# EAGLE design mitutoyo-spc-data-logger (EAGLE 5.11)
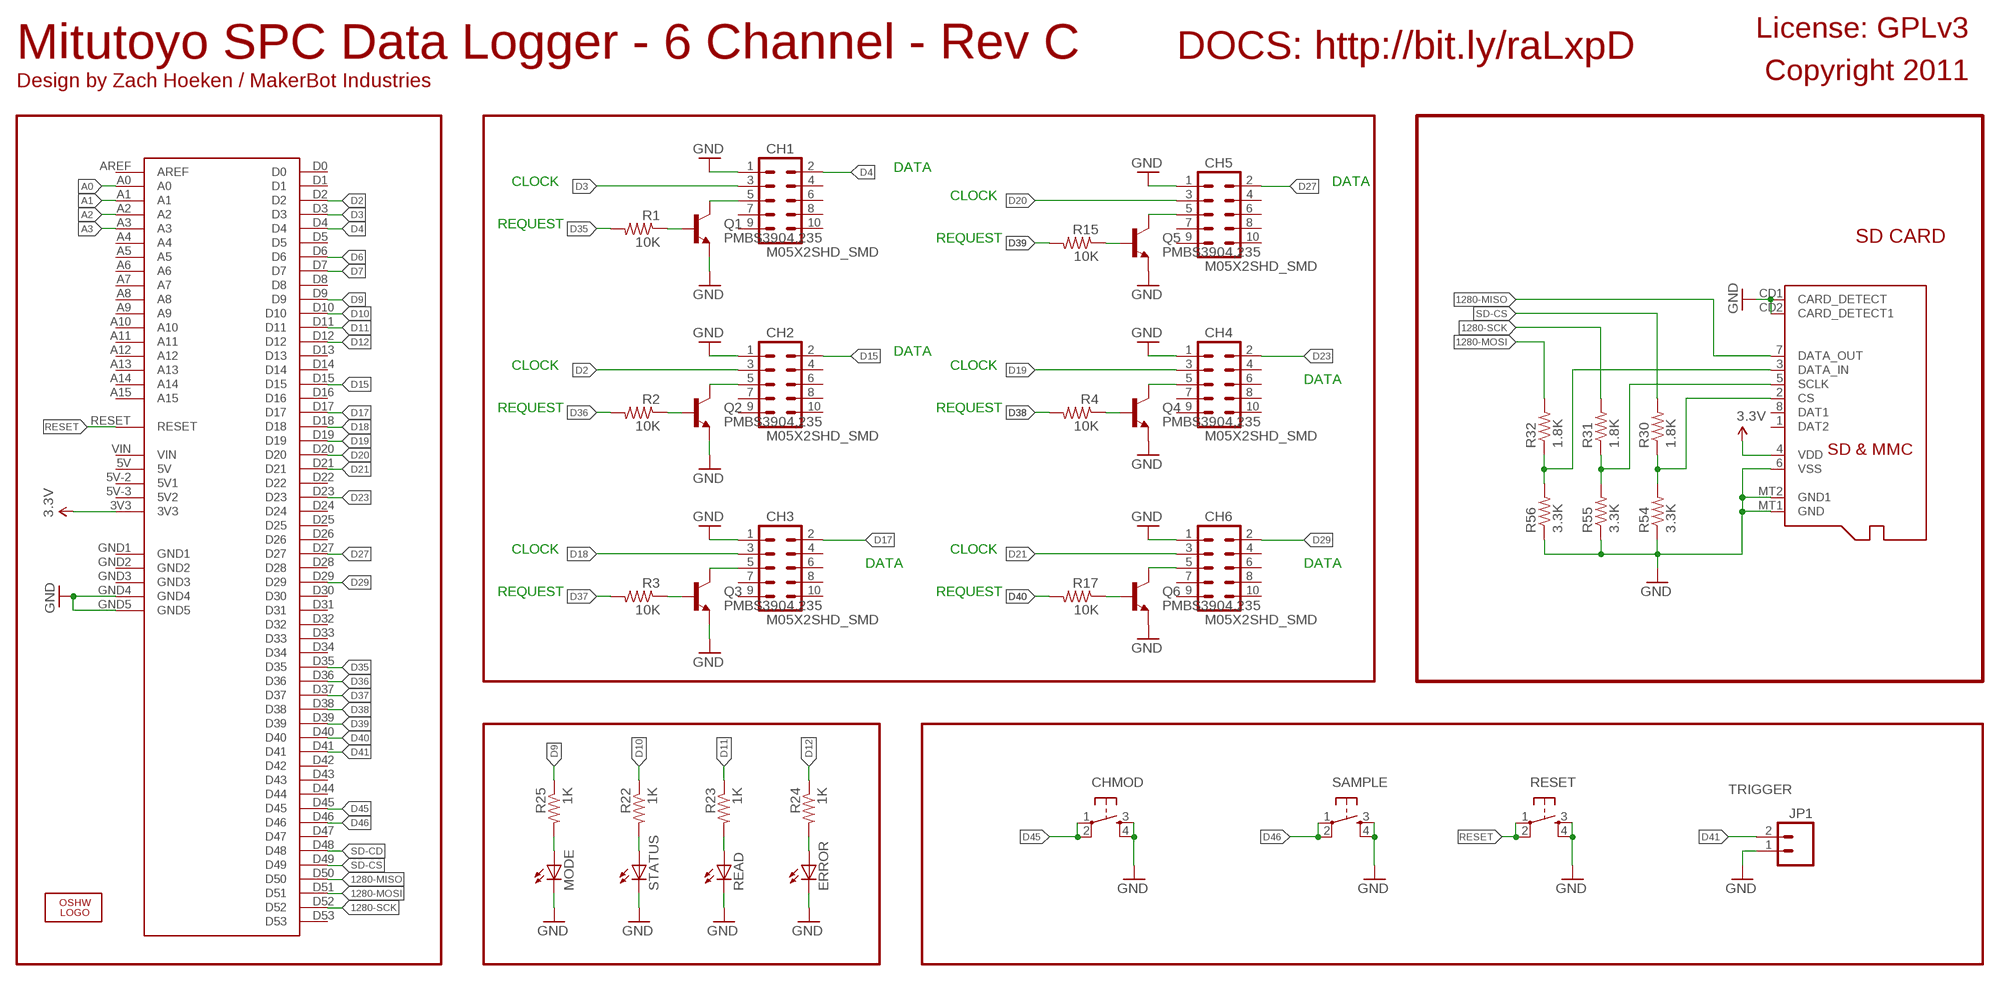
[diagram p0: schematic, sheet 1]

## Parts
CH1  M05X2SHD_SMD  [2X5-SHROUDED_SMD]
CH2  M05X2SHD_SMD  [2X5-SHROUDED_SMD]
CH3  M05X2SHD_SMD  [2X5-SHROUDED_SMD]
CH4  M05X2SHD_SMD  [2X5-SHROUDED_SMD]
CH5  M05X2SHD_SMD  [2X5-SHROUDED_SMD]
CH6  M05X2SHD_SMD  [2X5-SHROUDED_SMD]
CHMOD  TAC_SWITCHSMD  [TACTILE_SWITCH_SMD]
ERROR  LED1206  [LED-1206]
JP1  M02-JST-2MM-SMT  [S2B-PH]
LOGO2  OSHW_LOGO_10MILX0200-NT  [OSHW_10X200_NOTEXT]
MODE  LED1206  [LED-1206]
MP1  DNP  MICROSD  [MICROSD]
Q1  PMBS3904,235  TRANSISTOR_NPNSOT23  [SOT23]
Q2  PMBS3904,235  TRANSISTOR_NPNSOT23  [SOT23]
Q3  PMBS3904,235  TRANSISTOR_NPNSOT23  [SOT23]
Q4  PMBS3904,235  TRANSISTOR_NPNSOT23  [SOT23]
Q5  PMBS3904,235  TRANSISTOR_NPNSOT23  [SOT23]
Q6  PMBS3904,235  TRANSISTOR_NPNSOT23  [SOT23]
R1  10K  RESISTOR  [0805]
R2  10K  RESISTOR  [0805]
R3  10K  RESISTOR  [0805]
R4  10K  RESISTOR  [0805]
R15  10K  RESISTOR  [0805]
R17  10K  RESISTOR  [0805]
R22  1K  RESISTOR  [0805]
R23  1K  RESISTOR  [0805]
R24  1K  RESISTOR  [0805]
R25  1K  RESISTOR  [0805]
R30  1.8K  RESISTOR  [0805]
R31  1.8K  RESISTOR  [0805]
R32  1.8K  RESISTOR  [0805]
R54  3.3K  RESISTOR  [0805]
R55  3.3K  RESISTOR  [0805]
R56  3.3K  RESISTOR  [0805]
READ  LED1206  [LED-1206]
RESET  TAC_SWITCHSMD  [TACTILE_SWITCH_SMD]
SAMPLE  TAC_SWITCHSMD  [TACTILE_SWITCH_SMD]
STATUS  LED1206  [LED-1206]
U$1  ARDUINO-MEGA  [ARDUINO-MEGA]

## Nets
3.3V [3.3V]: MP1.4(VDD) U$1.3V3
1280-MISO: MP1.7(DATA_OUT) U$1.D50
1280-MOSI: R32.2 U$1.D51
1280-SCK: R31.2 U$1.D52
A0: U$1.A0
A1: U$1.A1
A2: U$1.A2
A3: U$1.A3
D2: CH2.3 U$1.D2
D3: CH1.3 U$1.D3
D4: CH1.2 U$1.D4
D6: U$1.D6
D7: U$1.D7
D9: R25.1 U$1.D9
D10: R22.1 U$1.D10
D11: R23.1 U$1.D11
D12: R24.1 U$1.D12
D15: CH2.2 U$1.D15
D17: CH3.2 U$1.D17
D18: CH3.3 U$1.D18
D19: CH4.3 U$1.D19
D20: CH5.3 U$1.D20
D21: CH6.3 U$1.D21
D23: CH4.2 U$1.D23
D27: CH5.2 U$1.D27
D29: CH6.2 U$1.D29
D35: R1.2 U$1.D35
D36: R2.2 U$1.D36
D37: R3.2 U$1.D37
D38: R4.2 U$1.D38
D39: R15.2 U$1.D39
D40: R17.2 U$1.D40
D41: JP1.2 U$1.D41
D45: CHMOD.1 CHMOD.2 U$1.D45
D46: SAMPLE.1 SAMPLE.2 U$1.D46
GND [gnd]: CH1.1 CH2.1 CH3.1 CH4.1 CH5.1 CH6.1 CHMOD.3 CHMOD.4 ERROR.C JP1.1 MODE.C MP1.6(VSS) MP1.CD1(CARD_DETECT) MP1.CD2(CARD_DETECT1) MP1.MT1(GND) MP1.MT2(GND1) Q1.2(E) Q2.2(E) Q3.2(E) Q4.2(E) Q5.2(E) Q6.2(E) R54.1 R55.1 R56.1 READ.C RESET.3 RESET.4 SAMPLE.3 SAMPLE.4 STATUS.C U$1.GND4 U$1.GND5
N$1: Q5.1(B) R15.1
N$2: CH1.5 Q1.3(C)
N$3: CH3.5 Q3.3(C)
N$4: CH4.5 Q4.3(C)
N$5: CH2.5 Q2.3(C)
N$6: Q6.1(B) R17.1
N$7: CH6.5 Q6.3(C)
N$8: CH5.5 Q5.3(C)
N$9: Q1.1(B) R1.1
N$10: R22.2 STATUS.A
N$11: Q2.1(B) R2.1
N$12: R23.2 READ.A
N$13: ERROR.A R24.2
N$14: Q3.1(B) R3.1
N$15: MODE.A R25.2
N$17: Q4.1(B) R4.1
N$219: MP1.2(CS) R30.1 R54.2
N$223: MP1.3(DATA_IN) R32.1 R56.2
N$224: MP1.5(SCLK) R31.1 R55.2
RESET: RESET.1 RESET.2 U$1.RESET
SD-CD: U$1.D48
SD-CS: R30.2 U$1.D49
Unconnected: CH1.4 CH1.6 CH1.7 CH1.8 CH1.9 CH1.10 CH2.4 CH2.6 CH2.7 CH2.8 CH2.9 CH2.10 CH3.4 CH3.6 CH3.7 CH3.8 CH3.9 CH3.10 CH4.4 CH4.6 CH4.7 CH4.8 CH4.9 CH4.10 CH5.4 CH5.6 CH5.7 CH5.8 CH5.9 CH5.10 CH6.4 CH6.6 CH6.7 CH6.8 CH6.9 CH6.10 MP1.1(DAT2) MP1.8(DAT1) U$1.5V U$1.5V-2(5V1) U$1.5V-3(5V2) U$1.A4 U$1.A5 U$1.A6 U$1.A7 U$1.A8 U$1.A9 U$1.A10 U$1.A11 U$1.A12 U$1.A13 U$1.A14 U$1.A15 U$1.AREF U$1.D0 U$1.D1 U$1.D5 U$1.D8 U$1.D13 U$1.D14 U$1.D16 U$1.D22 U$1.D24 U$1.D25 U$1.D26 U$1.D28 U$1.D30 U$1.D31 U$1.D32 U$1.D33 U$1.D34 U$1.D42 U$1.D43 U$1.D44 U$1.D47 U$1.D53 U$1.GND1 U$1.GND2 U$1.GND3 U$1.VIN

## Notes on the sheet
- License: GPLv3
- Mitutoyo SPC Data Logger - 6 Channel - Rev C | DOCS: http://bit.ly/raLxpD | Copyright 2011
- Design by Zach Hoeken / MakerBot Industries
- DATA
- CLOCK | DATA
- CLOCK
- REQUEST
- REQUEST | SD CARD
- DATA
- CLOCK | CLOCK
- DATA
- REQUEST | REQUEST
- CLOCK | CLOCK
- DATA | DATA
- REQUEST | REQUEST
- TRIGGER

## Library data of the parts
CH1-CH6 = SparkFun:M05X2: Header 5x2 Standard 10-pin dual row 0.1" header. Commonly used with AVR-ISP. Use with Spark Fun Electronics SKU: PRT-00778
CHMOD RESET SAMPLE = SparkFun:TAC_SWITCH: Momentary Switch Button commonly used for reset or general input. Spark Fun Electronics SKU : COM-00097
ERROR MODE READ STATUS = SparkFun:LED: LEDs Standard schematic elements and footprints for 5mm, 3mm, 1206, and 0603 sized LEDs. 5mm - Spark Fun Electronics SKU : COM-00529 (and others)
JP1 = SparkFun:M02: Header 2 Standard 2-pin 0.1" header. Use with straight break away headers (SKU : PRT-00116), right angle break away headers (PRT-00553), swiss pins (PRT-00743), machine pins (PRT-00117), and female headers (PRT-00115). Molex polarized connector foot print use with SKU : PRT-08233 with associated crimp pins and housings.
LOGO2 = OSHW:OSHW_LOGO_10MIL
MP1 = adafruit:MICROSD: Micro-SD / Transflash card holder with SPI pinout For the 3M # 2908-05WB-MG and/or 4UCON #19656 push-push type
Q1-Q6 = SparkFun:TRANSISTOR_NPN: Transistor NPN BJT configuration in SOT23 package. MMBT2222 is the common NPN we use. Double check BCE configuration again layout.
R1-R4 R15 R17 R22-R25 R30-R32 R54-R56 = SparkFun:RESISTOR: Resistor Basic schematic elements and footprints for 0603, 1206, and PTH 1/10th watt (small) resistors.
U$1 = MakerBot:ARDUINO-MEGA

## Net classes
0 default: width 0.254 mm, drill 0.508 mm, clearance 0.305 mm
2 gnd: width 0.254 mm, drill 0.508 mm, clearance 0.305 mm
3 5V: width 0.254 mm, drill 0.508 mm, clearance 0.305 mm
4 3.3V: width 0.254 mm, drill 0.508 mm, clearance 0.305 mm

## Board
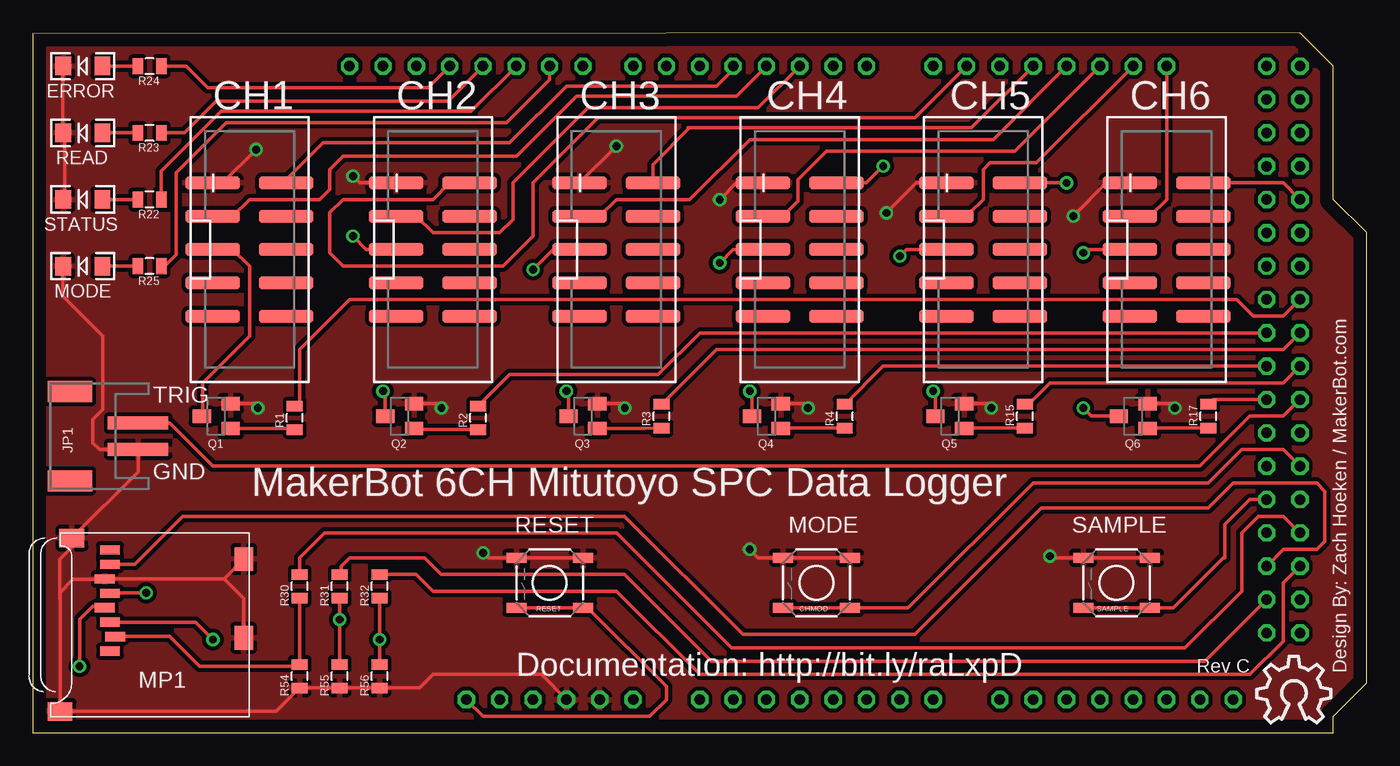
[diagram p1: board, top side]
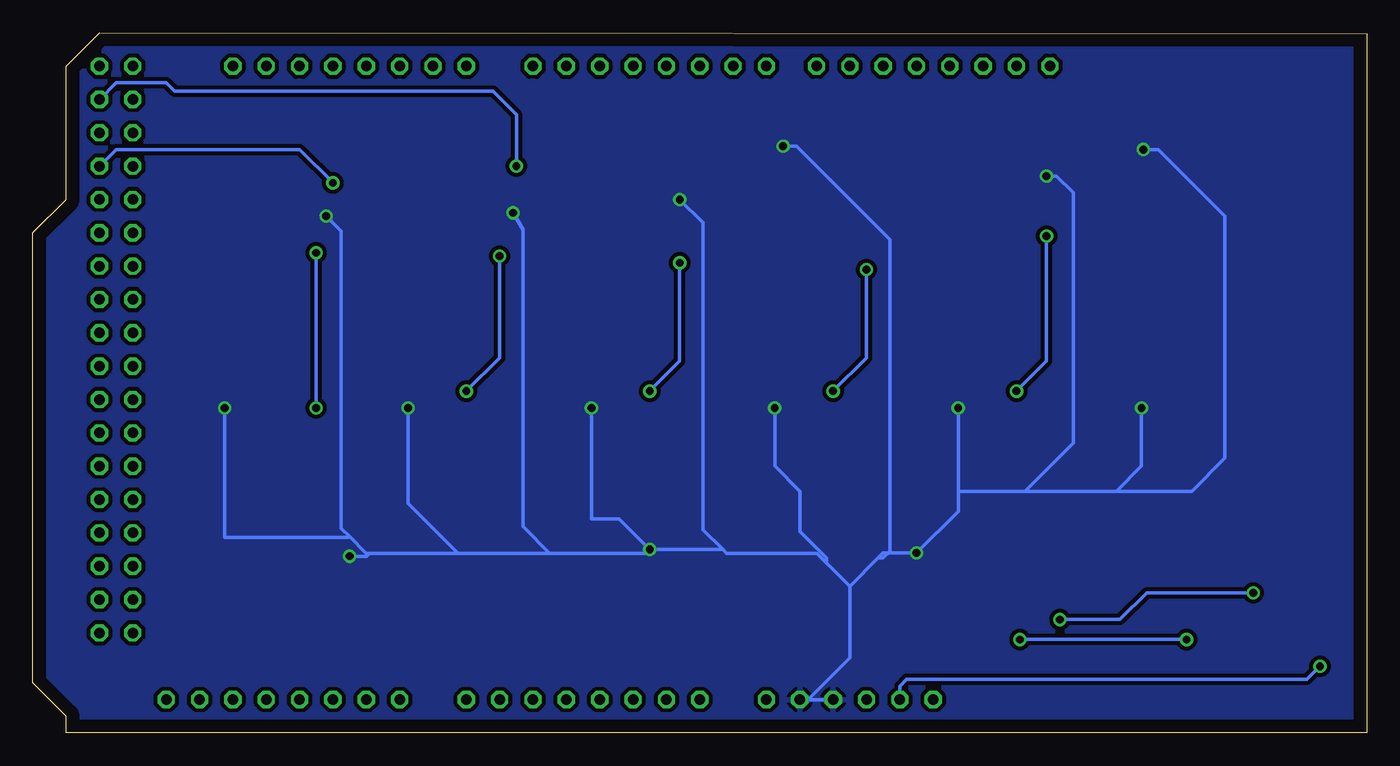
[diagram p2: board, bottom side, seen from below]

Size 101.6 x 53.34 mm. Coordinates in mm from the lower left corner, seen from the top.
Outline: 0,0 99.06,0 99.06,1.27 101.6,3.81 101.6,38.1 99.06,40.64 99.06,50.8 96.52,53.34 0,53.26 0,0
Copper layers (1*16): Top 0.035mm / dielectric 1.5mm / Bottom 0.035mm
Design rules "default *": minimum track width 10mil, minimum drill 24mil, track to track 12mil, track to pad 12mil, pad to pad 12mil, via to via 12mil, smd to smd 10mil, copper to edge 40mil, drill to drill 8mil, minimum pad ring 10mil, minimum via ring 8mil, stop-mask expansion 4mil, vias tented up to drill 0mil, thermal gap 12mil

### Footprints (pad centres in the part's own frame; a part is rotated, then mirrored left to right if it is on the bottom)
2X5-SHROUDED_SMD = smd 4.15 x 1: 1 -2.794,5.08; 2 2.794,5.08; 3 -2.794,2.54; 4 2.794,2.54; 5 -2.794,0; 6 2.794,0; 7 -2.794,-2.54; 8 2.794,-2.54; 9 -2.794,-5.08; 10 2.794,-5.08
TACTILE_SWITCH_SMD = smd 1.524 x 0.762: 1 -2.54,1.905; 2 2.54,1.905; 3 -2.54,-1.905; 4 2.54,-1.905
LED-1206 = smd 1.2 x 1.4: A -1.5,0; C 1.5,0
S2B-PH = smd 1 x 4.6: 1 -1,-3.7; 2 1,-3.7 | smd 1.6 x 3.4: NC1 -3.4,1.5; NC2 3.4,1.5
MICROSD = smd 0.7 x 1.5: 1 9,-10.64; 2 7.9,-10.24; 3 6.8,-10.64; 4 5.7,-11.04; 5 4.6,-10.64; 6 3.5,-11.04; 7 2.4,-10.64; 8 1.3,-10.64 | smd 1.8 x 1.4: CD1 2,-0.44; CD2 8,-0.44 | smd 1.4 x 1.9: MT1 0.4,-13.54; MT2 13.6,-14.44
SOT23 = smd 1 x 1.4: 1 -0.95,-1.1; 2 0.95,-1.1; 3 0,1.1
0805 = smd 0.8 x 1.2: 1 -0.9,0; 2 0.9,0
ARDUINO-MEGA = drill 0.8 octagon: 3V3 35.56,2.54; 5V 93.98,50.8; 5V-2 96.52,50.8; 5V-3 38.1,2.54; A0 50.8,2.54; A1 53.34,2.54; A2 55.88,2.54; A3 58.42,2.54; A4 60.96,2.54; A5 63.5,2.54; A6 66.04,2.54; A7 68.58,2.54; A8 73.66,2.54; A9 76.2,2.54; A10 78.74,2.54; A11 81.28,2.54; A12 83.82,2.54; A13 86.36,2.54; A14 88.9,2.54; A15 91.44,2.54; AREF 24.13,50.8; D0 63.5,50.8; D1 60.96,50.8; D2 58.42,50.8; D3 55.88,50.8; D4 53.34,50.8; D5 50.8,50.8; D6 48.26,50.8; D7 45.72,50.8; D8 41.91,50.8; D9 39.37,50.8; D10 36.83,50.8; D11 34.29,50.8; D12 31.75,50.8; D13 29.21,50.8; D14 68.58,50.8; D15 71.12,50.8; D16 73.66,50.8; D17 76.2,50.8; D18 78.74,50.8; D19 81.28,50.8; D20 83.82,50.8; D21 86.36,50.8; D22 93.98,48.26; D23 96.52,48.26; D24 93.98,45.72; D25 96.52,45.72; D26 93.98,43.18; D27 96.52,43.18; D28 93.98,40.64; D29 96.52,40.64; D30 93.98,38.1; D31 96.52,38.1; D32 93.98,35.56; D33 96.52,35.56; D34 93.98,33.02; D35 96.52,33.02; D36 93.98,30.48; D37 96.52,30.48; D38 93.98,27.94; D39 96.52,27.94; D40 93.98,25.4; D41 96.52,25.4; D42 93.98,22.86; D43 96.52,22.86; D44 93.98,20.32; D45 96.52,20.32; D46 93.98,17.78; D47 96.52,17.78; D48 93.98,15.24; D49 96.52,15.24; D50 93.98,12.7; D51 96.52,12.7; D52 93.98,10.16; D53 96.52,10.16; GND1 26.67,50.8; GND2 93.98,7.62; GND3 96.52,7.62; GND4 40.64,2.54; GND5 43.18,2.54; RESET 33.02,2.54; VIN 45.72,2.54

### Placement (x,y rotation side)
CH1  16.51,36.83 0 top
CH2  30.48,36.83 0 top
CH3  44.45,36.83 0 top
CH4  58.42,36.83 0 top
CH5  72.39,36.83 0 top
CH6  86.36,36.83 0 top
CHMOD  59.69,11.43 180 top
ERROR  3.81,50.8 180 top
JP1  4.32,22.61 90 top
LOGO2  93.22,0.76 0 top
MODE  3.81,35.56 180 top
MP1  16.51,15.24 270 top
Q1  13.97,24.13 90 top
Q2  27.94,24.13 90 top
Q3  41.91,24.13 90 top
Q4  55.88,24.13 90 top
Q5  69.85,24.13 90 top
Q6  83.82,24.13 90 top
R1  19.94,24 90 top
R2  33.91,24 90 top
R3  47.88,24.13 90 top
R4  61.85,24.13 90 top
R15  75.56,24.13 90 top
R17  89.53,24.13 90 top
R22  8.89,40.64 180 top
R23  8.89,45.72 180 top
R24  8.89,50.8 180 top
R25  8.89,35.56 180 top
R30  20.32,11.18 90 top
R31  23.37,11.18 90 top
R32  26.42,11.18 90 top
R54  20.32,4.32 90 top
R55  23.37,4.32 90 top
R56  26.42,4.32 90 top
READ  3.81,45.72 180 top
RESET  39.37,11.43 180 top
SAMPLE  82.55,11.43 180 top
STATUS  3.81,40.64 180 top
U$1  0,0 0 top

### Tracks (layer width: path | path; a pad name or v marks a point on that pad's centre or on a via)
3.3V  (via drill 0.6)
  Top 0.254: v3.56,5.08 3.56,8.64 4.57,9.65 5.36,9.65 MP1.4
  Bottom 0.254: U$1.3V3 35.56,3.56 35.05,4.06 4.57,4.06 v3.56,5.08
1280-MISO
  Top 0.254: MP1.7 7.76,12.84 11.43,16.51 45.09,16.51 54.1,7.49 67.18,7.49 76.83,17.14 89.53,17.14 91.44,19.05 97.79,19.05 98.42,18.41 98.42,14.61 97.79,13.97 95.25,13.97 U$1.D50
1280-MOSI
  Top 0.254: U$1.D51 95.25,11.43 95.25,6.99 92.71,4.45 50.8,4.45 44.45,10.79 30.48,10.79 29.21,12.06 26.43,12.06 R32.2
1280-SCK
  Top 0.254: U$1.D52 89.28,5.46 51.69,5.46 45.09,12.06 31.11,12.06 29.84,13.34 24.13,13.34 23.81,13.02 23.5,12.7 23.5,12.2 R31.2
D2
  Top 0.254: U$1.D2 55.24,47.62 42.29,47.62 36.58,41.91 36.58,39.12 35.56,38.1 30.48,38.1 29.21,39.37 CH2.3
D3
  Top 0.254: U$1.D3 53.59,48.51 41.4,48.51 36.83,43.94 23.62,43.94 22.61,42.93 22.61,41.4 21.84,40.64 16.51,40.64 15.24,39.37 CH1.3
D4
  Top 0.254: U$1.D4 53.34,50.55 52.07,49.28 40.64,49.28 36.32,44.96 22.1,44.96 19.3,42.16 CH1.2
D9
  Top 0.254: U$1.D9 39.37,49.78 36.07,46.48 14.73,46.48 10.92,42.67 10.92,36.44 10.04,35.56 R25.1
D10
  Top 0.254: U$1.D10 33.4,47.37 14.35,47.37 9.79,42.81 R22.1
D11
  Top 0.254: U$1.D11 31.62,48.13 13.97,48.13 11.56,45.72 R23.1
D12
  Top 0.254: U$1.D12 30.1,49.15 13.34,49.15 11.68,50.8 R24.1
D15
  Top 0.254: U$1.D15 67.18,46.86 43.05,46.86 38.1,41.91 38.1,37.85 35.81,35.56 23.62,35.56 22.61,36.58 22.61,39.62 23.62,40.64 30.48,40.64 31.75,41.91 CH2.2
D17
  Top 0.254: U$1.D17 71.5,46.1 50.04,46.1 | 50.04,46.1 49.91,46.1 | CH3.2 47.24,43.31 50.04,46.1
D18
  Top 0.254: U$1.D18 73.15,45.21 54.61,45.21 50.04,40.64 44.45,40.64 43.18,39.37 CH3.3
D19
  Top 0.254: U$1.D19 74.8,44.32 60.45,44.32 58.29,42.16 58.29,40.51 57.15,39.37 CH4.3
D20
  Top 0.254: U$1.D20 76.45,43.43 72.9,43.43 72.39,42.93 72.39,40.64 71.37,39.62 69.85,39.62 CH5.3
D21
  Top 0.254: CH6.3 85.09,39.37 86.36,40.64 U$1.D21
D23  (via drill 0.6)
  Top 0.254: CH4.2 63.5,41.91 v64.77,43.18
  Bottom 0.254: U$1.D23 95.25,49.53 91.44,49.53 90.81,48.9 66.55,48.9 64.77,47.12 v64.77,43.18
D27  (via drill 0.6)
  Top 0.254: CH5.2 v78.74,41.91
  Bottom 0.254: U$1.D27 95.25,44.45 81.28,44.45 v78.74,41.91
D29
  Top 0.254: U$1.D29 95.25,41.91 CH6.2
D35
  Top 0.254: U$1.D35 95.25,31.75 92.96,31.75 91.69,33.02 24.13,33.02 20.32,29.21 20.32,25.28 R1.2
D36
  Top 0.254: U$1.D36 50.8,30.48 47.62,27.3 36.31,27.3 R2.2
D37
  Top 0.254: U$1.D37 95.25,29.21 52.06,29.21 R3.2
D38
  Top 0.254: U$1.D38 64.76,27.94 R4.2
D39
  Top 0.254: R15.2 75.83,25.03 77.47,26.67 95.25,26.67 U$1.D39
D40
  Top 0.254: U$1.D40 89.91,25.4 R17.2
D41
  Top 0.254: U$1.D41 95.25,24.13 92.71,24.13 88.9,20.32 13.72,20.32 10.43,23.61 JP1.2
D45
  Top 0.254: U$1.D45 95.25,21.59 92.08,21.59 89.53,19.05 76.2,19.05 66.67,9.53 CHMOD.1 CHMOD.2
D46
  Top 0.254: U$1.D46 92.71,17.78 90.81,15.88 90.81,13.46 | 90.81,13.46 90.81,13.34 | SAMPLE.2 SAMPLE.1 86.87,9.53 90.81,13.46
GND  (via drill 0.6)
  Top 0.254: 2.07,10.16 MP1.MT2 18.54,1.64 R54.1 R55.1 R56.1 29.45,3.42 30.48,4.45 38.73,4.45 U$1.GND4 | 2.07,10.16 2.07,10.71 3.05,11.68 5.41,11.68 MP1.6 14.57,11.74 | 2.07,10.16 2.03,10.2 2.03,13.21 2.97,14.15 MP1.MT1 8.02,19.89 JP1.1 7.49,21.59 5.08,21.59 4.57,22.1 4.57,23.88 5.33,24.64 5.33,30.23 2.29,33.27 2.29,35.56 MODE.C | ERROR.C 2.29,50.8 2.29,45.72 READ.C 2.41,45.72 2.41,40.77 STATUS.C | STATUS.C 2.29,40.64 | STATUS.C 2.41,40.64 | Q1.2 16.83,25.08 v17.14,24.77 | 14.57,11.74 MP1.CD1 | Q2.2 30.8,25.08 v31.11,24.77 | Q3.2 44.77,25.08 v45.09,24.77 | Q4.2 58.74,25.08 v59.05,24.77 | Q5.2 72.71,25.08 v73.03,24.77 | Q6.2 86.68,25.08 v87,24.77 | MP1.CD2 16.07,10.24 14.57,11.74 | RESET.3 RESET.4 34.67,13.34 v34.29,13.72 | v54.61,13.97 55.24,13.34 CHMOD.4 CHMOD.3 | v77.47,13.46 77.6,13.34 SAMPLE.4 SAMPLE.3 | CH6.1 81.79,41.91 v79.25,39.37 | CH5.1 67.31,41.91 v65.02,39.62 | CH4.1 53.59,41.91 v52.32,40.64 | 39.88,41.91 CH3.1 v44.45,44.7 | CH2.1 24.89,41.91 v24.38,42.42 | 13.34,41.91 14.48,41.91 v17.02,44.45
  Bottom 0.254: U$1.GND4 U$1.GND5 42.55,2.54 39.37,5.71 39.37,11.18 | 69.22,13.69 75.95,13.69 | 75.95,13.69 76.2,13.69 77.48,14.97 | v17.14,24.77 17.14,20.32 19.05,18.41 | 31.11,18.41 26.04,18.41 | 26.04,18.41 19.05,18.41 | 31.11,18.41 v31.11,24.77 | v45.09,24.77 45.09,20.32 43.18,18.41 43.18,15.37 41.15,13.34 41.15,12.95 | v59.05,24.77 59.05,16.31 56.95,16.31 v54.61,13.97 | v73.03,24.77 73.03,17.5 69.22,13.69 | v87,24.77 87,14.88 77.57,14.88 77.48,14.97 | 77.48,14.97 78.11,15.6 78.11,38.23 v79.25,39.37 | 62.23,13.69 64.26,15.72 64.26,38.35 v65.02,39.62 | 19.05,18.41 13.34,18.41 10.79,20.95 10.79,39.37 15.88,44.45 v17.02,44.45 | 37.21,13.34 36.83,13.72 v34.29,13.72 31.11,16.89 31.11,18.41 | 41.15,12.95 41.88,13.69 48.77,13.69 49.05,13.97 | 39.37,11.18 41.15,12.95 | 62.23,13.69 54.89,13.69 v54.61,13.97 | 62.23,13.69 69.22,13.69 | v77.47,13.46 76.17,13.46 75.95,13.69 | 49.05,13.97 v54.61,13.97 | v52.32,40.64 50.55,38.86 50.55,15.47 49.05,13.97 | v44.45,44.7 43.43,44.7 36.32,37.59 36.32,13.84 RESET.4 37.21,13.34 | 39.37,11.18 37.21,13.34 | v24.38,42.42 23.62,42.42 22.35,41.15 22.35,22.1 26.04,18.41
  pour Bottom: 0,0 101.6,0 101.6,53.34 0,53.34
  pour Top: 0,0 101.6,0 101.6,53.34 0,53.34
N$1
  Top 0.254: Q5.1 71,23.23 R15.1
N$2
  Top 0.254: CH1.5 15.24,36.83 16.51,35.56 16.51,30.23 12.95,26.67 12.95,24.21 Q1.3
N$3  (via drill 0.6)
  Top 0.254: Q3.3 40.81,25.86 v40.64,26.04 | CH3.5 39.62,36.83 v38.1,35.31
  Bottom 0.254: v38.1,35.31 38.1,28.57 v40.64,26.04
N$4  (via drill 0.6)
  Top 0.254: Q4.3 54.78,25.86 v54.61,26.04 | CH4.5 53.34,36.83 v52.32,35.81
  Bottom 0.254: v52.32,35.81 52.32,28.32 v54.61,26.04
N$5  (via drill 0.6)
  Top 0.254: Q2.3 26.84,25.86 v26.67,26.04 | CH2.5 25.4,36.83 v24.38,37.85
  Bottom 0.254: v24.38,37.85 24.38,28.32 v26.67,26.04
N$6
  Top 0.254: Q6.1 84.97,23.23 R17.1
N$7  (via drill 0.6)
  Top 0.254: Q6.3 80.64,24.13 v80.01,24.77 | CH6.5 80.26,36.83 v80.01,36.58
  Bottom 0.254: v80.01,24.77 v80.01,36.58
N$8  (via drill 0.6)
  Top 0.254: Q5.3 68.75,25.86 v68.58,26.04 | CH5.5 66.55,36.83 v66.04,36.32
  Bottom 0.254: v66.04,36.32 66.04,28.57 v68.58,26.04
N$9
  Top 0.254: R1.1 19.23,23.18 Q1.1
N$10
  Top 0.254: STATUS.A R22.2
N$11
  Top 0.254: Q2.1 29.12,23.1 R2.1
N$12
  Top 0.254: READ.A R23.2
N$13
  Top 0.254: ERROR.A R24.2
N$14
  Top 0.254: R3.1 46.56,23.18 Q3.1
N$15
  Top 0.254: MODE.A R25.2
N$17
  Top 0.254: Q4.1 57.03,23.23 R4.1
N$219
  Top 0.254: R30.1 R54.2 20.18,5.08 12.7,5.08 10.44,7.34 MP1.2
N$223  (via drill 0.6)
  Top 0.254: MP1.3 12.39,8.44 v13.72,7.11 | R56.2 v26.42,7.11 R32.1
  Bottom 0.254: v13.72,7.11 v26.42,7.11
N$224  (via drill 0.6)
  Top 0.254: R31.1 v23.37,8.64 R55.2 | v8.64,10.67 5.9,10.67 MP1.5
  Bottom 0.254: v23.37,8.64 18.8,8.64 16.76,10.67 v8.64,10.67
RESET
  Top 0.254: U$1.RESET 34.29,1.27 46.99,1.27 48.26,2.54 48.26,3.53 42.27,9.53 RESET.1 RESET.2
SD-CS
  Top 0.254: R30.2 20.32,13.34 22.23,15.24 44.45,15.24 53.21,6.48 87.76,6.48 92.08,10.79 92.08,15.24 93.34,16.51 95.25,16.51 U$1.D49

### Text on the board
tPlace: CH1 | CH2 | CH3 | CH4 | CH5 | CH6 | TRIG | GND | MakerBot 6CH Mitutoyo SPC Data Logger | RESET | MODE | SAMPLE | Rev C | Design By: Zach Hoeken / MakerBot.com | Documentation: http://bit.ly/raLxpD